# Altium schematic sheet RS232ToWifi.SchDoc
size A4; CheckedBy: Everyone how cares; DocumentNumber: 1; SheetNumber: 1; SheetTotal: 4
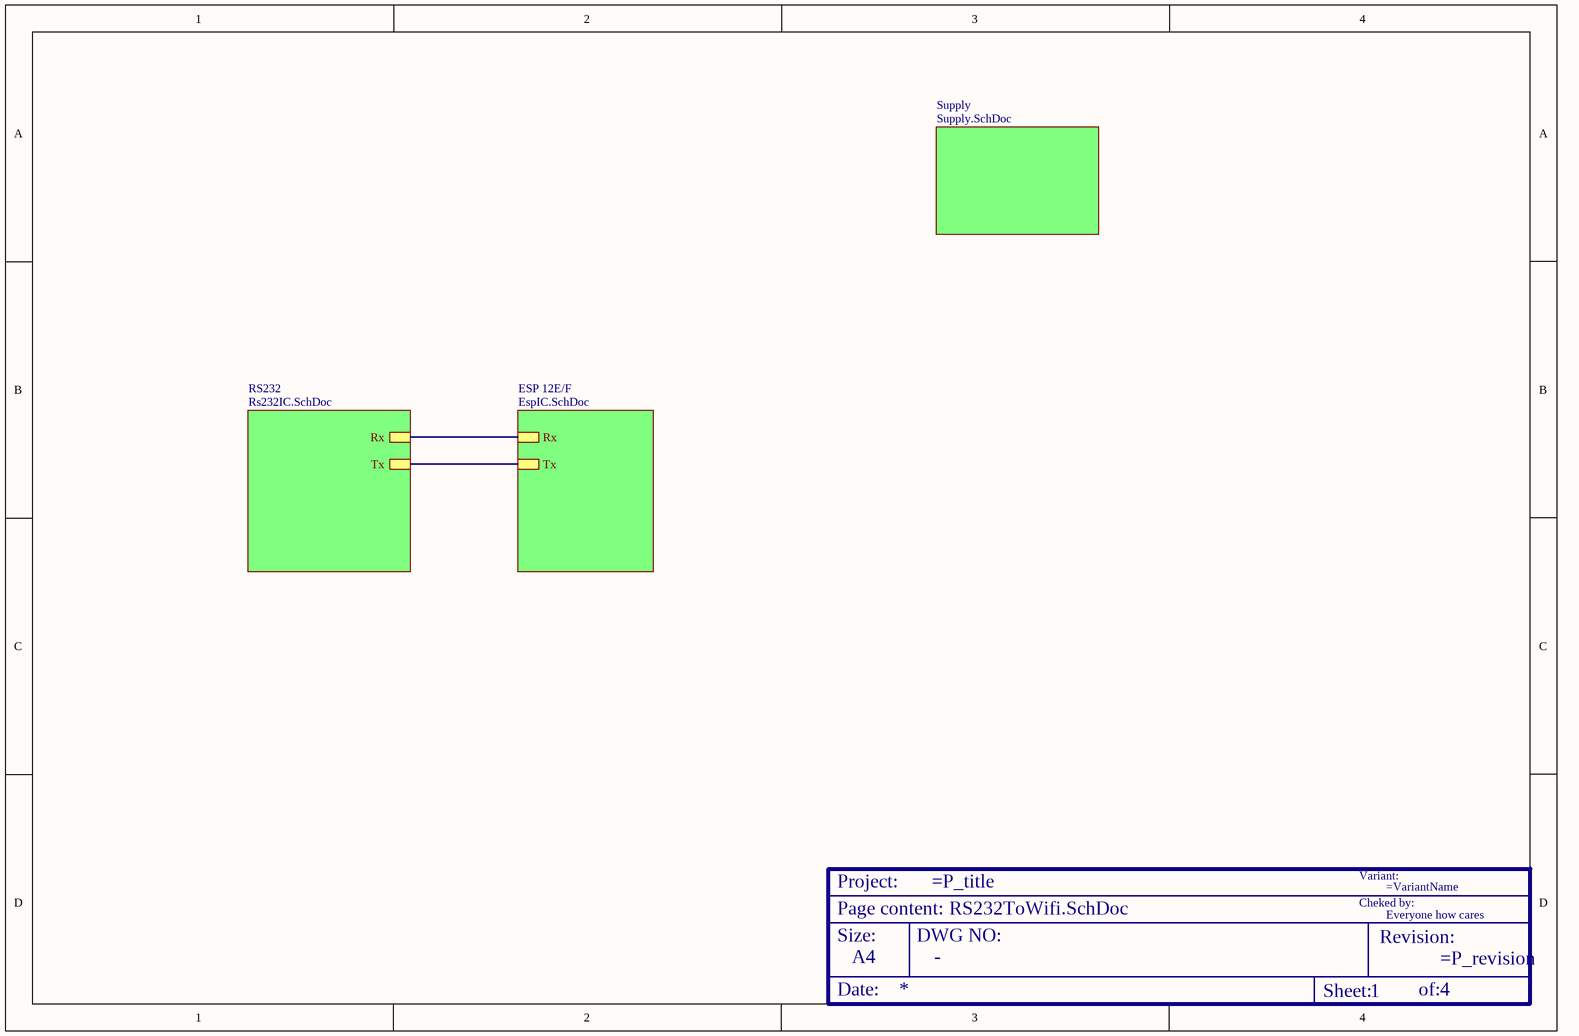
[diagram p0: RS232ToWifi.SchDoc]

## Parts
?  Size: A4  (hidden comment: TitleBox)  (graphical)

## Sub-sheets
ESP 12E/F = EspIC.SchDoc: Tx, Rx
RS232 = Rs232IC.SchDoc: Rx, Tx
Supply = Supply.SchDoc: no entries

## Nets
(unnamed): sheet RS232/Rx, sheet ESP 12E/F/Rx
(unnamed): sheet RS232/Tx, sheet ESP 12E/F/Tx

## Notes on the sheet
- (in symbol TitleBox_1) Variant:; Project:; Cheked by:; Page content:; Size:; DWG NO:; Revision:; Date:; Sheet:; of:

## Library data of the parts
? = TitleBox_1: coordenadas: (610;20) Size A4; DWG No: -